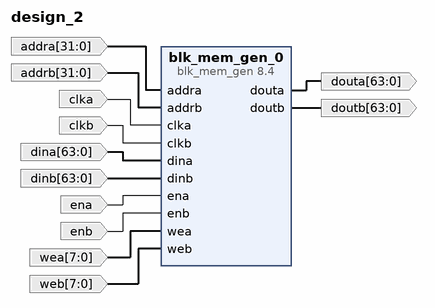
[diagram p0: block diagram of the top level]
# Vivado block design design_2, xck26-sfvc784-2LV-c, Vivado 2025.1
create_bd_design design_2

create_bd_port -dir I enb
create_bd_port -dir O -from 63 -to 0 doutb
create_bd_port -dir I -from 7 -to 0 web
create_bd_port -dir I -from 63 -to 0 dinb
create_bd_port -dir I -type clk clkb
set_property -dict {CONFIG.FREQ_HZ 300000000} [get_bd_ports clkb]
create_bd_port -dir I -from 31 -to 0 addrb
create_bd_port -dir I -from 7 -to 0 wea
create_bd_port -dir I ena
create_bd_port -dir O -from 63 -to 0 douta
create_bd_port -dir I -from 63 -to 0 dina
create_bd_port -dir I -type clk clka
set_property -dict {CONFIG.FREQ_HZ 300000000} [get_bd_ports clka]
create_bd_port -dir I -from 31 -to 0 addra

create_bd_cell -type ip -vlnv xilinx.com:ip:blk_mem_gen:8.4 blk_mem_gen_0
set_property -dict [list \
  CONFIG.Assume_Synchronous_Clk false \
  CONFIG.Enable_32bit_Address true \
  CONFIG.Enable_B Use_ENB_Pin \
  CONFIG.Memory_Type True_Dual_Port_RAM \
  CONFIG.Port_B_Clock 100 \
  CONFIG.Port_B_Enable_Rate 100 \
  CONFIG.Port_B_Write_Rate 50 \
  CONFIG.Read_Width_A 64 \
  CONFIG.Read_Width_B 64 \
  CONFIG.Register_PortA_Output_of_Memory_Core true \
  CONFIG.Register_PortA_Output_of_Memory_Primitives true \
  CONFIG.Register_PortB_Output_of_Memory_Primitives true \
  CONFIG.Use_RSTA_Pin false \
  CONFIG.Use_RSTB_Pin false \
  CONFIG.Write_Width_A 64 \
  CONFIG.Write_Width_B 64 \
  CONFIG.use_bram_block Stand_Alone \
] [get_bd_cells blk_mem_gen_0]

# ---- connections ----

connect_bd_net [get_bd_ports addra] [get_bd_pins blk_mem_gen_0/addra]
connect_bd_net [get_bd_ports addrb] [get_bd_pins blk_mem_gen_0/addrb]
connect_bd_net [get_bd_pins blk_mem_gen_0/douta] [get_bd_ports douta]
connect_bd_net [get_bd_pins blk_mem_gen_0/doutb] [get_bd_ports doutb]
connect_bd_net [get_bd_ports clka] [get_bd_pins blk_mem_gen_0/clka]
connect_bd_net [get_bd_ports clkb] [get_bd_pins blk_mem_gen_0/clkb]
connect_bd_net [get_bd_ports dina] [get_bd_pins blk_mem_gen_0/dina]
connect_bd_net [get_bd_ports dinb] [get_bd_pins blk_mem_gen_0/dinb]
connect_bd_net [get_bd_ports ena] [get_bd_pins blk_mem_gen_0/ena]
connect_bd_net [get_bd_ports enb] [get_bd_pins blk_mem_gen_0/enb]
connect_bd_net [get_bd_ports wea] [get_bd_pins blk_mem_gen_0/wea]
connect_bd_net [get_bd_ports web] [get_bd_pins blk_mem_gen_0/web]

validate_bd_design
save_bd_design
